# Altium schematic sheet DB10011_Power.SchDoc: Power supplies
size A3; Engineer: Danny Bokma; Revision: V0.3; SheetNumber: 4; SheetTotal: 7
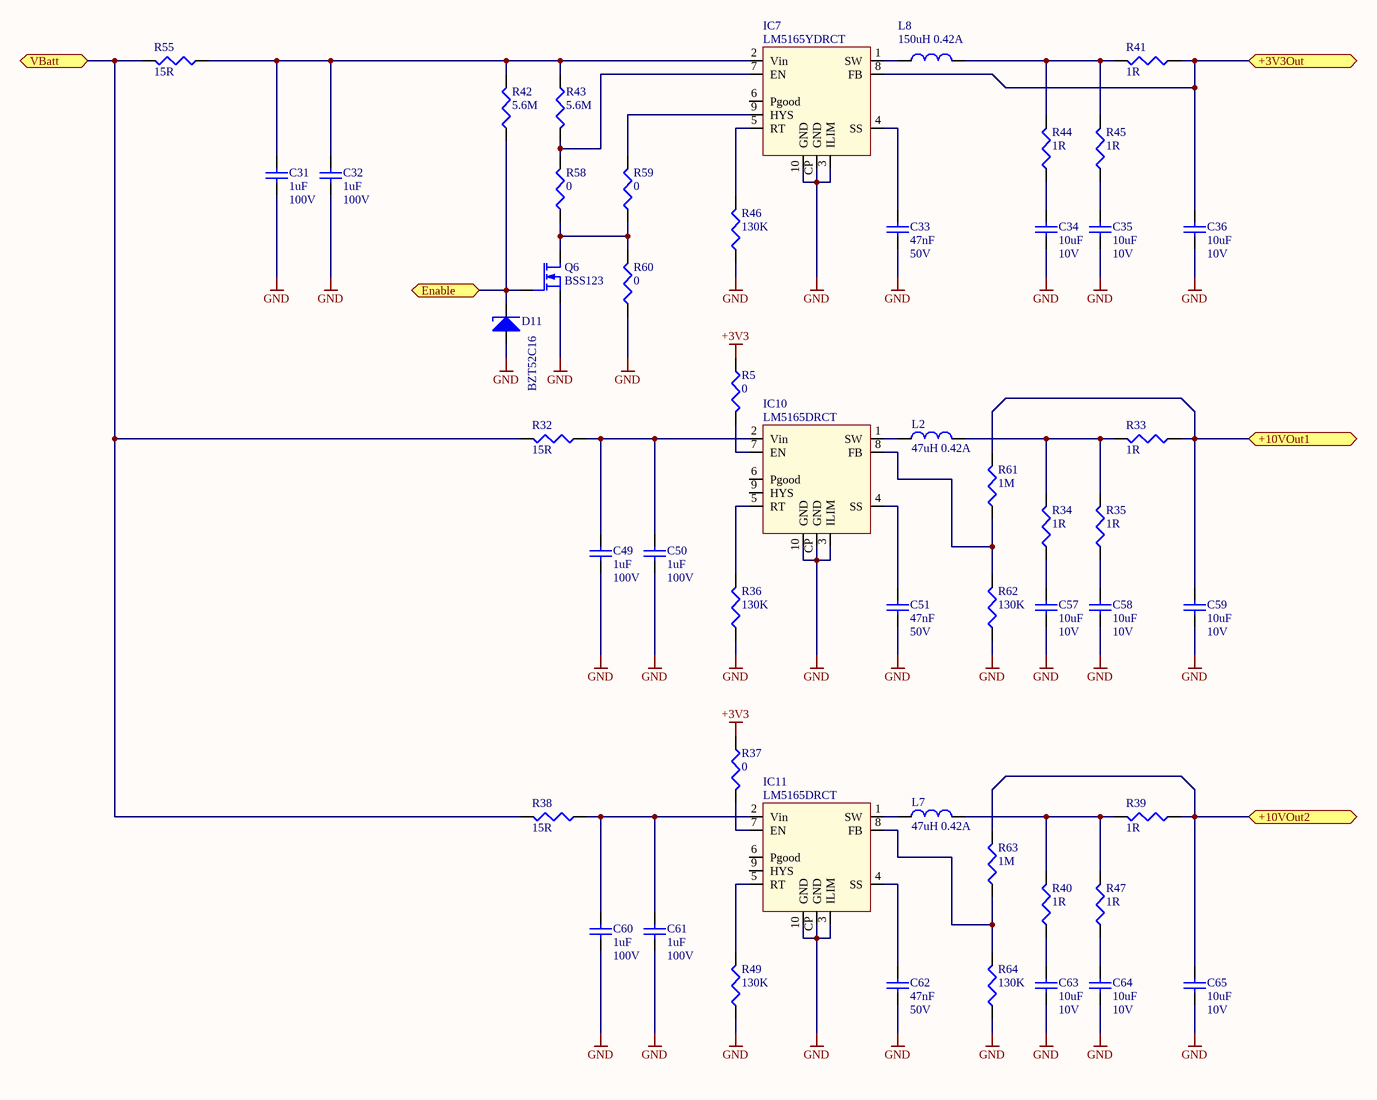
[diagram p0: DB10011_Power.SchDoc]

## Parts
C31  1uF  Voltage Rating: 100V  [C-1206]
C32  1uF  Voltage Rating: 100V  [C-1206]
C33  47nF  Voltage Rating: 50V  [C0603]
C34  10uF  Voltage Rating: 10V  [C-0805]
C35  10uF  Voltage Rating: 10V  [C-0805]
C36  10uF  Voltage Rating: 10V  [C-0805]
C49  1uF  Voltage Rating: 100V  [C-1206]
C50  1uF  Voltage Rating: 100V  [C-1206]
C51  47nF  Voltage Rating: 50V  [C0603]
C57  10uF  Voltage Rating: 10V  [C-0805]
C58  10uF  Voltage Rating: 10V  [C-0805]
C59  10uF  Voltage Rating: 10V  [C-0805]
C60  1uF  Voltage Rating: 100V  [C-1206]
C61  1uF  Voltage Rating: 100V  [C-1206]
C62  47nF  Voltage Rating: 50V  [C0603]
C63  10uF  Voltage Rating: 10V  [C-0805]
C64  10uF  Voltage Rating: 10V  [C-0805]
C65  10uF  Voltage Rating: 10V  [C-0805]
D11  BZT52C16  [SOD123]
IC7  LM5165YDRCT  [PWSON10]
IC10  LM5165DRCT  [PWSON10]
IC11  LM5165DRCT  [PWSON10]
L2  47uH 0.42A  [WE-TPC 4828, MH]
L7  47uH 0.42A  [WE-TPC 4828, MH]
L8  150uH 0.42A  [WE-TPC 4828, MH]
Q6  BSS123  [SOT-23]
R5  0  [0402]
R32  15R  [0805]
R33  1R  [0805]
R34  1R  [0805]
R35  1R  [0805]
R36  130K  [0603]
R37  0  [0402]
R38  15R  [0805]
R39  1R  [0805]
R40  1R  [0805]
R41  1R  [0805]
R42  5.6M  [0805]
R43  5.6M  [0805]
R44  1R  [0805]
R45  1R  [0805]
R46  130K  [0603]
R47  1R  [0805]
R49  130K  [0603]
R55  15R  [0805]
R58  0  [0402]
R59  0  [0402]
R60  0  [0402]
R61  1M  [0402]
R62  130K  [0603]
R63  1M  [0402]
R64  130K  [0603]

## Ports
+3V3Out, +10VOut1, +10VOut2, Enable, VBatt

## Nets
+3V3: R5.1 R37.1
GND: C31.1 C32.1 C33.1 C34.1 C35.1 C36.1 C49.1 C50.1 C51.1 C57.1 C58.1 C59.1 C60.1 C61.1 C62.1 C63.1 C64.1 C65.1 D11.1(A) IC7.3(ILIM) IC7.10(GND) IC7.CP(GND) IC10.3(ILIM) IC10.10(GND) IC10.CP(GND) IC11.3(ILIM) IC11.10(GND) IC11.CP(GND) Q6.S R36.1 R46.1 R49.1 R60.1 R62.1 R64.1
+3V3Out: C36.2 IC7.8(FB) R41.1 ; port +3V3Out
+10VOut1: C59.2 R33.1 R61.2 ; port +10VOut1
+10VOut2: C65.2 R39.1 R63.2 ; port +10VOut2
Enable: D11.2(K) Q6.G R42.1 ; port Enable
VBatt: R32.2 R38.2 R55.2 ; port VBatt
NetC31_2: C31.2 C32.2 IC7.2(Vin) R42.2 R43.1 R55.1
NetC33_2: C33.2 IC7.4(SS)
NetC34_2: C34.2 R44.1
NetC35_2: C35.2 R45.1
NetC49_2: C49.2 C50.2 IC10.2(Vin) R32.1
NetC51_2: C51.2 IC10.4(SS)
NetC57_2: C57.2 R34.1
NetC58_2: C58.2 R35.1
NetC60_2: C60.2 C61.2 IC11.2(Vin) R38.1
NetC62_2: C62.2 IC11.4(SS)
NetC63_2: C63.2 R40.1
NetC64_2: C64.2 R47.1
NetIC7_1: IC7.1(SW) L8.1
NetIC7_5: IC7.5(RT) R46.2
NetIC7_7: IC7.7(EN) R43.2 R58.2
NetIC7_9: IC7.9(HYS) R59.2
NetIC10_1: IC10.1(SW) L2.1
NetIC10_5: IC10.5(RT) R36.2
NetIC10_7: IC10.7(EN) R5.2
NetIC10_8: IC10.8(FB) R61.1 R62.2
NetIC11_1: IC11.1(SW) L7.1
NetIC11_5: IC11.5(RT) R49.2
NetIC11_7: IC11.7(EN) R37.2
NetIC11_8: IC11.8(FB) R63.1 R64.2
NetL2_2: L2.2 R33.2 R34.2 R35.2
NetL7_2: L7.2 R39.2 R40.2 R47.2
NetL8_2: L8.2 R41.2 R44.2 R45.2
NetQ6_D: Q6.D R58.1 R59.1 R60.2

Not connected (* = marked no-connect by the designer): IC7 6(Pgood); IC10 6(Pgood) 9(HYS); IC11 6(Pgood) 9(HYS)

## Notes on the sheet
- Title
- Size:
- Date:
- A3
- Number:
- Time:
- Revision:
- Sheet
- of
- File:

## Library data of the parts
C31 C32 C49 C50 C60 C61 = 1uF/1206/CER/100V: Capacitor, 1uF, 100V, X7R; Capacitance Tolerance: ± 10%; Capacitor Case Style: 1206; Brand Number: 12061C105K4Z2A; Brand: AVX; Dielectric Characteristic: X7R; Capacitance: 1uF; Temperature Range: -55°C to +125°C; Price: 0,52; Order Code Supplier: 1833855; Supplier: Farnell
C33 C51 C62 = 47nF/0603/CER/50V: Capacitor, 47nF, 50V, X7R; Capacitance Tolerance: ± 10%; Capacitor Case Style: 0603; Brand Number: MCCA000249; Brand: MULTICOMP; Dielectric Characteristic: X7R; Capacitance: 47nF; Temperature Range: -55°C to +125°C; Price: 0,009; Order Code Supplier: 1759116; Supplier: Farnell
C34-C36 C57-C59 C63-C65 = 10uF/0805/CER/10V: Capacitor, 10uF, 10V, X7R; Capacitance Tolerance: ± 10%; Capacitor Case Style: 0805; Brand Number: GRM21BR71A106KE51L; Brand: MURATA; Dielectric Characteristic: X7R; Capacitance: 10uF; Temperature Range: -55°C to +125°C; Price: 0,36; Order Code Supplier: 1828828; Supplier: Farnell
D11 = BZT52C16: Diode Zener, Vz: 16V, If: 0.1A, Vf: 0.9V; Brand: Diodes; Case Style: SOD-123; Brand Number: BZT52C16; Forward Current: 0.1A; Forward Voltage: 0.9V; Order Code Supplier: 1902431; Price: 0,087; Supplier: Farnell; Temperature Range: -65°C to +150°C; Zener Voltage: 16V
IC7 = LM5165Y: Buck Vreg 150mA 3V3 out 5-65Vin; Brand: Texas Instruments; Case Style: MSOP-8; Price: 3,70; Order Code Supplier: 595-LM5165YDRCT; Brand Number: LM5165YDRCT; Temperature Range: -40°C to +85°C; Supplier: Mouser
IC10 IC11 = LM5165D: Buck Vreg 150mA Adj Vout 5-65Vin; Brand: Texas Instruments; Case Style: MSOP-8; Price: 3,70; Order Code Supplier: 595-LM5165DRCT; Brand Number: LM5165DRCT; Temperature Range: -40°C to +85°C; Supplier: Mouser
L2 L7 = 744043470: 47UH, 30%, 0.75A; Brand: Wurth; Case Style: WE-TPC 4828; Inductance: 150uH; DC Resistance: 0.280ohm; Brand Number: 744043470; DC Current: 0.75A; Order Code Supplier: 1890607; Price: 1,36; Q Factor: *; Supplier: Farnell; Temperature Range: -40°C to +125°C
L8 = 744043151: 150UH, 30%, 0.42A; Brand: Wurth; Case Style: WE-TPC 4828; DC Resistance: 0.770ohm; Brand Number: 744043151; DC Current: 0.42A; Inductance: 150uH; Order Code Supplier: 2082517; Price: 1,36; Q Factor: *; Supplier: Farnell; Temperature Range: -40°C to +125°C
Q6 = BSS123: Mosfet, N-channel, Vds:100V, Id:0.15A, Vgs-th:2.8V, Rds-on:3.5ohm; Brand: NXP; Drain Current: 0.15A; Drain Source Voltage: 100V; Gate Source Voltage: 20V; On Resistance: 3.5ohm; Threshold Voltage: 2.8V; Brand Number: BSS123; Case Style: SOT-23; Order Code Supplier: 1510764; Price: 0,082; Supplier: Farnell; Temperature Range: -55°C to +150°C; Transistor Polarity: N-channel
R5 R37 R58-R60 = 0/0402/0063W/50V: Resistor, 0, 0.1%, 0.0625W, 50V, 100PPM, 0402; Brand: VISHAY DRALORIC; Brand Number: CRCW04020000Z0ED; Power Rating: 0.063W; Case Style: 0402; Order Code Supplier: 2121349; Price: 0,0021; Resistance: 0; Supplier: Farnell; Temperature Coefficient: ± 100PPM; Temperature Range: -55°C to +125°C; Voltage Rating: 50V
R32 R38 R55 = 15/0805/0125W/150V: Resistor, 15R, 0.1%, 0.125W, 150V, 15PPM, 0805; Brand: YAGEO; Brand Number: RC0805JR-0715RL; Case Style: 0805; Order Code Supplier: 9233784; Power Rating: 0.125W; Price: 0,0161; Resistance: 15R; Supplier: Farnell; Temperature Coefficient: ± 15PPM; Temperature Range: -55°C to +155°C; Voltage Rating: 150V
R33-R35 R39-R41 R44 R45 R47 = 1/0805/0250W/150V: Resistor, 1R, 1%, 0.25W, 150V, 200PPM, 0805; Brand: PANASONIC; Brand Number: ERJ6BQF1R0V; Case Style: 0805; Order Code Supplier: 1717826; Power Rating: 0.25W; Price: 0,28; Resistance: 1R; Supplier: Farnell; Temperature Coefficient: ± 200PPM; Temperature Range: -55°C to +125°C; Voltage Rating: 150V
R36 R46 R49 R62 R64 = 130K/0603/0063W/50V: Resistor, 130K, 1%, 0.063W, 50V, 100PPM, 0603; Brand: VISHAY DRALORIC; Brand Number: CRCW0603130KFKEA; Case Style: 0603; Order Code Supplier: 2122632; Power Rating: 0.063W; Price: 0,017; Resistance: 130K; Supplier: Farnell; Temperature Coefficient: ± 100PPM; Temperature Range: -55°C to +125°C; Voltage Rating: 50V
R42 R43 = 5.6M/0805/0250W/150V: Resistor, 5.6M, 1%, 0.25W, 150V, 100PPM, 0805; Brand: MULTICOMP; Brand Number: MCHP05W4F5604T5E; Case Style: 0805; Order Code Supplier: 1576517; Power Rating: 0.25W; Price: 0,089; Resistance: 5.6M; Supplier: Farnell; Temperature Coefficient: ± 100PPM; Temperature Range: -55°C to +155°C; Voltage Rating: 150V
R61 R63 = 1M/0402/0063W/50V: Resistor, 1M, 0.1%, 0.0625W, 50V, 100PPM, 0402; Brand: VISHAY DRALORIC; Brand Number: CRCW04021M00FKED; Power Rating: 0.063W; Case Style: 0402; Order Code Supplier: 2121984; Price: 0,0006; Resistance: 1M; Supplier: Farnell; Temperature Coefficient: ± 100PPM; Temperature Range: -55°C to +125°C; Voltage Rating: 50V